# Altium schematic sheet CD Spot Welder Control Circuit Schematic_2023-06-06.schdoc
size 292 x 216 mm
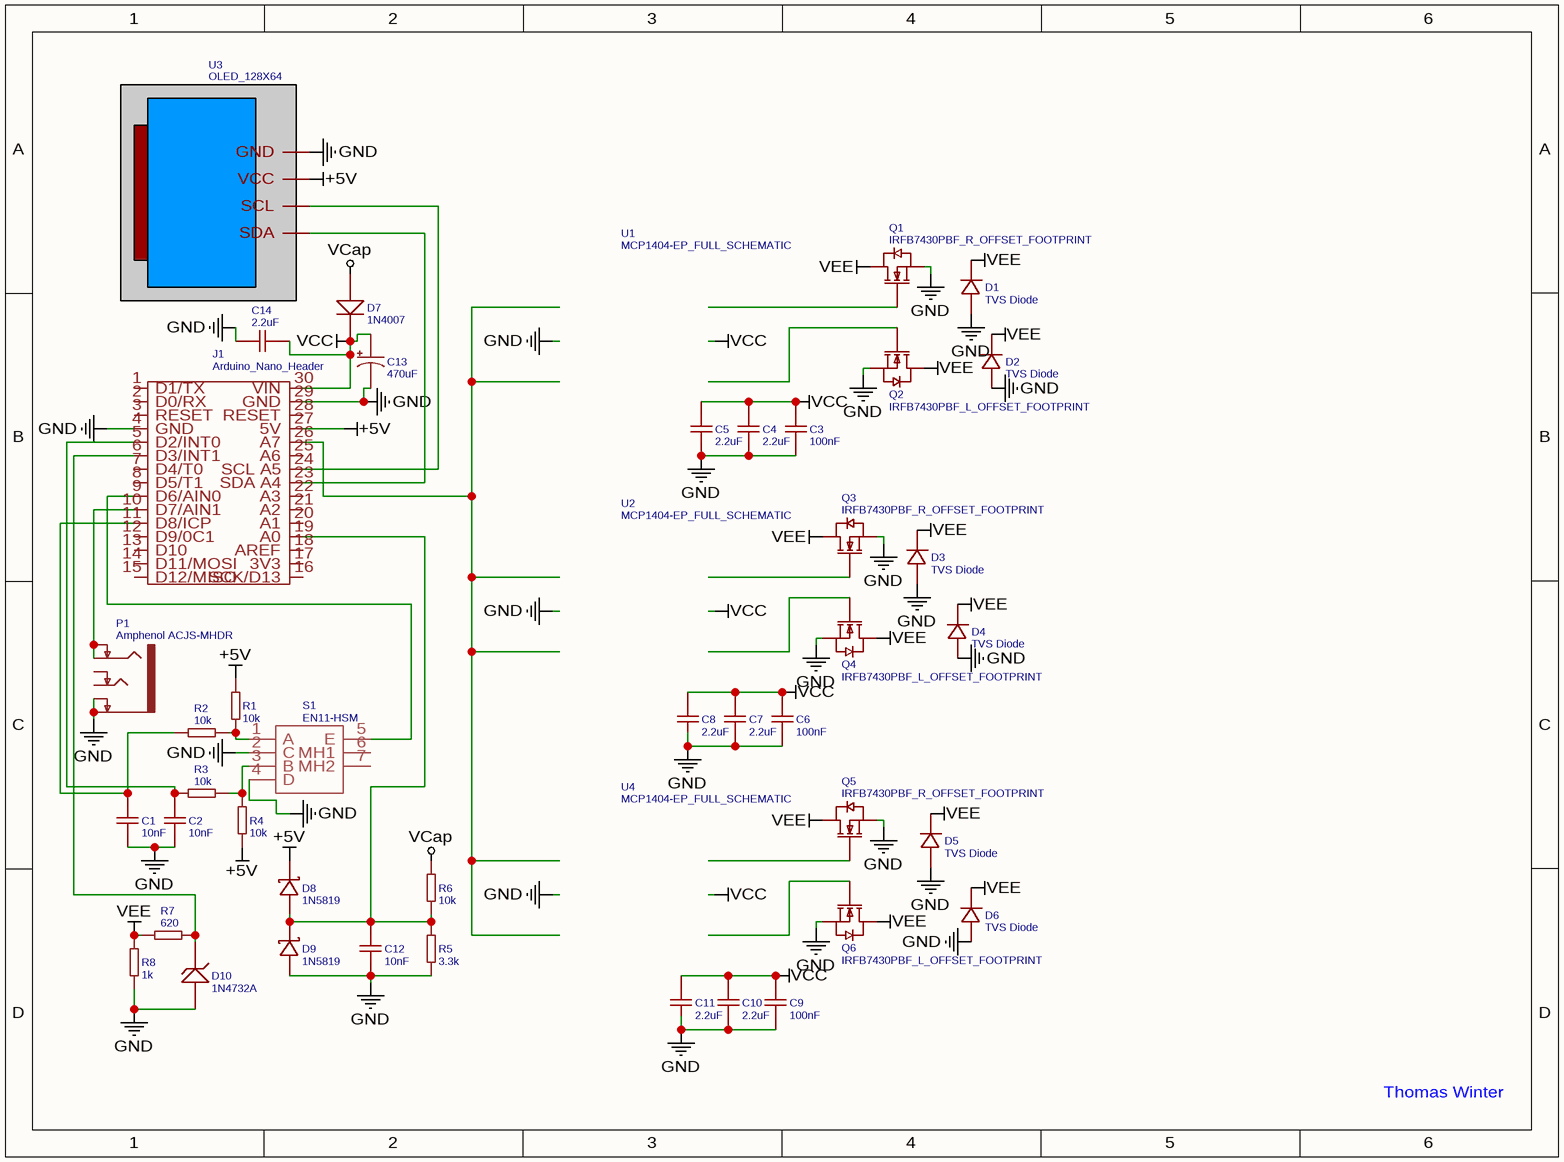
[diagram p0: CD Spot Welder Control Circuit Schematic_2023-06-06.schdoc]

## Parts
C1  10nF  [C1206]
C2  10nF  [C1206]
C3  100nF  [C1206]
C4  2.2uF  [C1206]
C5  2.2uF  [C1206]
C6  100nF  [C1206]
C7  2.2uF  [C1206]
C8  2.2uF  [C1206]
C9  100nF  [C1206]
C10  2.2uF  [C1206]
C11  2.2uF  [C1206]
C12  10nF  [C1206]
C13  470uF  [CAP-D12.5XF5.0]
C14  2.2uF  [C1206]
D1  TVS Diode  [SMC(DO-214AB)]
D2  TVS Diode  [SMC(DO-214AB)]
D3  TVS Diode  [SMC(DO-214AB)]
D4  TVS Diode  [SMC(DO-214AB)]
D5  TVS Diode  [SMC(DO-214AB)]
D6  TVS Diode  [SMC(DO-214AB)]
D7  1N4007  [DO-41]
D8  1N5819  [DO-41]
D9  1N5819  [DO-41]
D10  1N4732A  [DO-41]
J1  Arduino_Nano_Header  [DIP-30_L43.18-W15.24-ARDUINONANO]
P1  Amphenol ACJS-MHDR  [AMPHENOL ACJS-MHDR]
Q1  IRFB7430PBF_R_OFFSET_FOOTPRINT  [TO-220-3_MIDDLE_OFFSET_R]
Q2  IRFB7430PBF_L_OFFSET_FOOTPRINT  [TO-220-3_MIDDLE_OFFSET_L]
Q3  IRFB7430PBF_R_OFFSET_FOOTPRINT  [TO-220-3_MIDDLE_OFFSET_R]
Q4  IRFB7430PBF_L_OFFSET_FOOTPRINT  [TO-220-3_MIDDLE_OFFSET_L]
Q5  IRFB7430PBF_R_OFFSET_FOOTPRINT  [TO-220-3_MIDDLE_OFFSET_R]
Q6  IRFB7430PBF_L_OFFSET_FOOTPRINT  [TO-220-3_MIDDLE_OFFSET_L]
R1  10k  [RTH025W]
R2  10k  [RTH025W]
R3  10k  [RTH025W]
R4  10k  [RTH025W]
R5  3.3k  [RTH025W]
R6  10k  [RTH025W]
R7  620  [RTH025W]
R8  1k  [RTH025W]
S1  EN11-HSM  [EN11HSM1BF20]
U1  MCP1404-EP_FULL_SCHEMATIC  [DIP8]
U2  MCP1404-EP_FULL_SCHEMATIC  [DIP8]
U3  OLED_128X64  [OLED_128X64]
U4  MCP1404-EP_FULL_SCHEMATIC  [DIP8]

## Nets
+5V: D8.2(K) J1.27(5V) R1.2 R4.1 U3.2(VCC)
GND: C1.1 C2.1 C3.1 C4.1 C5.1 C6.1 C7.1 C8.1 C9.1 C10.1 C11.1 C12.1 C13.2 C14.2 D1.1(A) D2.1(A) D3.1(A) D4.1(A) D5.1(A) D6.1(A) D9.1(A) D10.1(A) J1.4(GND) J1.29(GND) P1.S P1.SN Q1.3(S) Q2.3(S) Q3.3(S) Q4.3(S) Q5.3(S) Q6.3(S) R5.1 R8.1 S1.2(C) S1.4(D) U3.1(GND)
VCap: D7.1(A) R6.2
VCC: C3.2 C4.2 C5.2 C6.2 C7.2 C8.2 C9.2 C10.2 C11.2 C13.1 C14.1 D7.2(K) J1.30(VIN)
VEE: D1.2(C) D2.2(C) D3.2(C) D4.2(C) D5.2(C) D6.2(C) Q1.2(D) Q2.2(D) Q3.2(D) Q4.2(D) Q5.2(D) Q6.2(D) R7.2 R8.2
NetC1_2: C1.2 J1.11(D8/ICP) R2.2
NetC2_2: C2.2 J1.5(D2/INT0) R3.2
NetC12_2: C12.2 D8.1(A) D9.2(K) J1.19(A0) R5.2 R6.1
NetD10_2: D10.2(K) J1.6(D3/INT1) R7.1
NetJ1_9: J1.9(D6/AIN0) S1.5(E)
NetJ1_10: J1.10(D7/AIN1) P1.T P1.TN
NetJ1_23: J1.23(SDA_A4) U3.4(SDA)
NetJ1_24: J1.24(SCL_A5) U3.3(SCL)
NetR1_1: R1.1 R2.1 S1.1(A)
NetR3_1: R3.1 R4.2 S1.3(B)

Not connected (* = marked no-connect by the designer): J1 1(D1/TX) 2(D0/RX) 3(RESET) 7(D4/T0) 8(D5/T1) 12(D9/0C1) 13(D10) 14(D11/MOSI) 15(D12/MISO) 16(SCK/D13) 17(3V3) 18(AREF) 20(A1) 21(A2) 22(A3) 25(A6) 26(A7) 28(RESET); P1 R RN; Q1 1(G); Q2 1(G); Q3 1(G); Q4 1(G); Q5 1(G); Q6 1(G); S1 6(MH1) 7(MH2)

## Notes on the sheet
- Thomas Winter

## Library data of the parts
C1 C2 C12 = 10nF: nameAlias: Value(F); spicePre: C; spiceSymbolName: Cap_RAD-0.1_US
C3 C6 C9 = 100nF: BOM_Manufacturer: TORCH; BOM_Manufacturer Part: CT41G-0805-2X1-50V-0.1uF-K(N); nameAlias: Capacitance; Contributor: LCSC; BOM_Supplier: LCSC; BOM_Supplier Part: C126469; spicePre: C; spiceSymbolName: CT41G-0805-2X1-50V-0.1UF-K(N)
C4 C5 C7 C8 C10 C11 C14 = 2.2uF: BOM_Manufacturer: TORCH; BOM_Manufacturer Part: CT41G-0805-2X1-50V-0.1uF-K(N); nameAlias: Capacitance; Contributor: LCSC; BOM_Supplier: LCSC; BOM_Supplier Part: C126469; spicePre: C; spiceSymbolName: CT41G-0805-2X1-50V-0.1UF-K(N)
C13 = 470uF: nameAlias: Value(F); spicePre: C; spiceSymbolName: Cap_Electrolytic(TH)_D12.5XF5.0_US
D1-D6 = TVS Diode: BOM_Manufacturer Part: ES3G; BOM_Manufacturer: MDD; SMT Type: Extend; BOM_Supplier: LCSC; image: //image.lceda.cn/szlcsc/C64978.jpg; BOM_Supplier Part: C64978; BOM_LCSC Assembly: Yes; spicePre: D; spiceSymbolName: ES3G
D7 = 1N4007: description: 1.0 Ampere General Purpose Rectifier; spicePre: D; spiceSymbolName: 1N4007
D8 D9 = 1N5819: BOM_Manufacturer: MDD; BOM_Supplier Part: C2474; BOM_Supplier: LCSC; BOM_Manufacturer Part: 1N5819; spicePre: D; spiceSymbolName: 1N5819
D10 = 1N4732A: description: One Watt Zener; spicePre: D; spiceSymbolName: 1N4732A
P1 = Amphenol ACJS-MHDR: Contributor: SparkFun; sourceId: nlfxrJtPy; spicePre: P; spiceSymbolName: Amphenol ACJS-MHDR copy
Q1 Q3 Q5 = IRFB7430PBF_R_OFFSET_FOOTPRINT: BOM_Manufacturer: International Rectifier; Contributor: twinter145; BOM_Supplier: LCSC; BOM_Supplier Part: C46358; BOM_Manufacturer Part: IRFB7430PBF; spicePre: Q; spiceSymbolName: IRFB7430PBF_R_OFFSET_FOOTPRINT
Q2 Q4 Q6 = IRFB7430PBF_L_OFFSET_FOOTPRINT: BOM_Manufacturer: International Rectifier; Contributor: twinter145; BOM_Supplier: LCSC; BOM_Supplier Part: C46358; BOM_Manufacturer Part: IRFB7430PBF; spicePre: Q; spiceSymbolName: IRFB7430PBF_L_OFFSET_FOOTPRINT
R1-R4 R6 = 10k: Contributor: DangerousPrototype; spicePre: R; spiceSymbolName: RESISTOR
R5 = 3.3k: Contributor: DangerousPrototype; spicePre: R; spiceSymbolName: RESISTOR
R7 = 620: Contributor: DangerousPrototype; spicePre: R; spiceSymbolName: RESISTOR
R8 = 1k: Contributor: DangerousPrototype; spicePre: R; spiceSymbolName: RESISTOR
S1 = EN11-HSM: Contributor: carlo1300; spicePre: S; spiceSymbolName: EN11-HSM
U1 U2 U4 = MCP1404-EP_FULL_SCHEMATIC: description: 4.5A Dual High-Speed Power MOSFET Drivers, Non Inverting, Extended Temperature; Contributor: twinter145; spicePre: U; spiceSymbolName: MCP1404-EP_FULL_SCHEMATIC
U3 = OLED_128X64: BOM_Manufacturer Part: OLED 128x64 12C Display; Contributor: ksnboopa; spicePre: U; spiceSymbolName: OLED_128X64
J1 = Arduino_Nano_Header: spicePre: J; spiceSymbolName: Arduino_Nano_Header